# Altium schematic sheet GSM LED Indicators.SchDoc: GSM Modem Signal Indicator LED's
size A3; DocumentNumber: 12; SheetNumber: 12; SheetTotal: 54
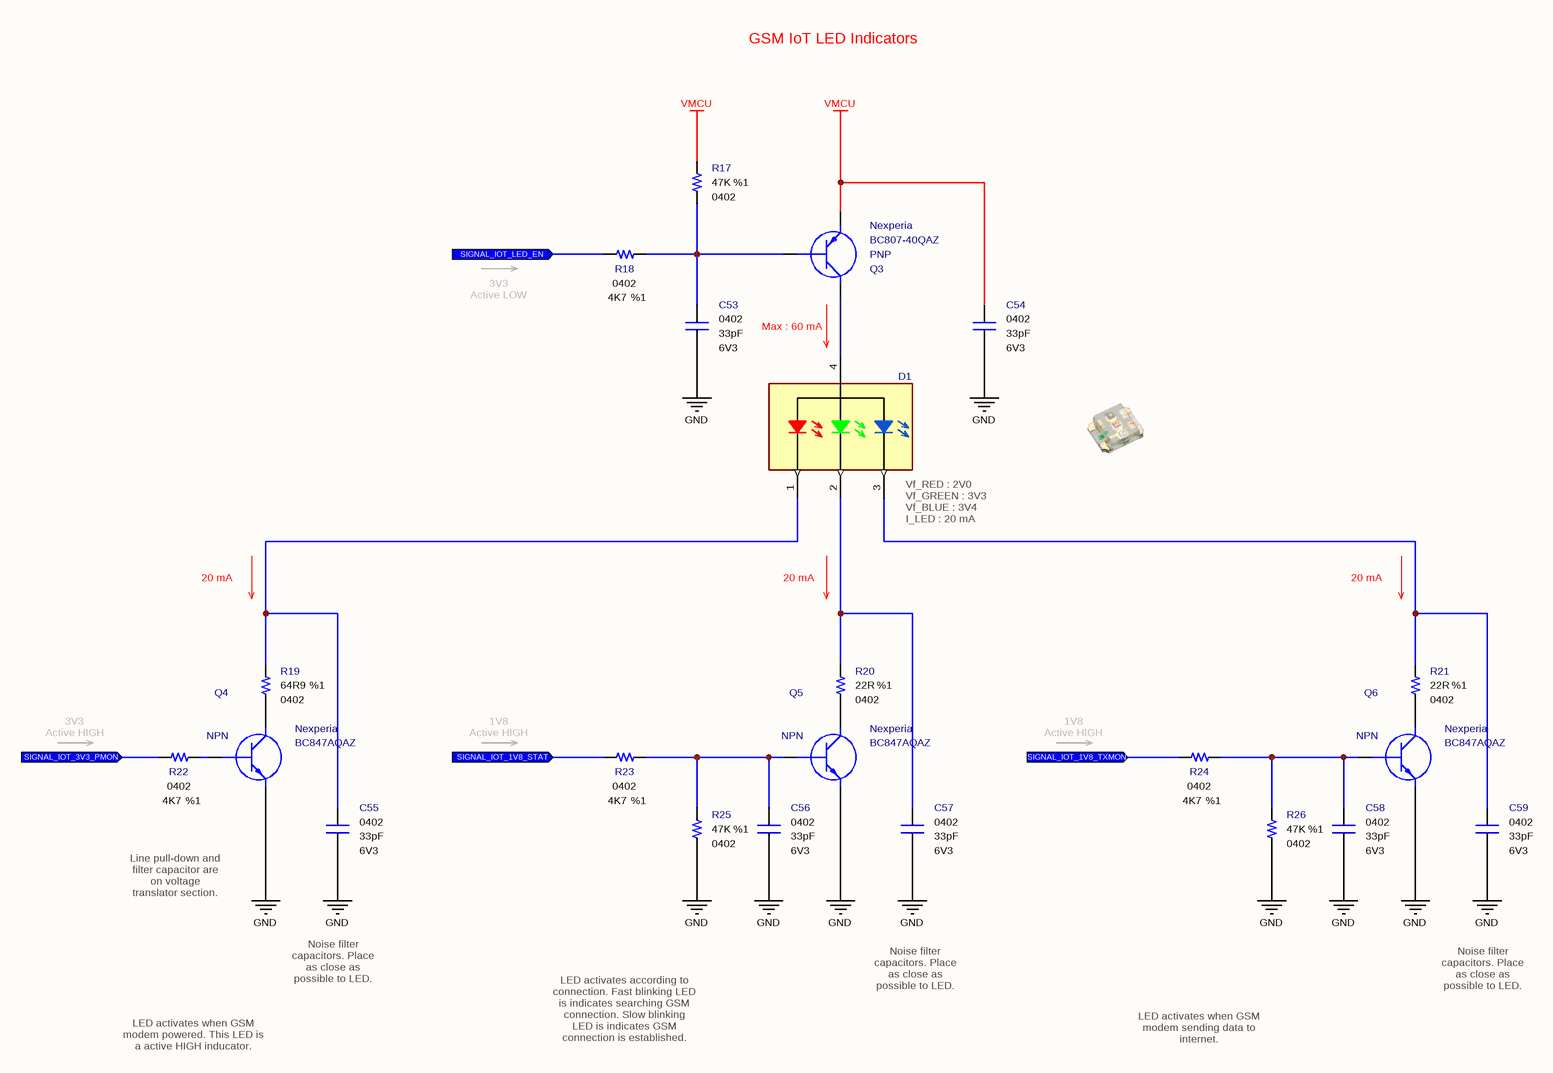
[diagram p0: GSM LED Indicators.SchDoc]

## Parts
C53  value 33pF  Case: 0402  Voltage: 6V3  [CAPACITOR_0402]  (hidden comment: Multilayer Ceramic Capacitor)
C54  value 33pF  Case: 0402  Voltage: 6V3  [CAPACITOR_0402]  (hidden comment: Multilayer Ceramic Capacitor)
C55  value 33pF  Case: 0402  Voltage: 6V3  [CAPACITOR_0402]  (hidden comment: Multilayer Ceramic Capacitor)
C56  value 33pF  Case: 0402  Voltage: 6V3  [CAPACITOR_0402]  (hidden comment: Multilayer Ceramic Capacitor)
C57  value 33pF  Case: 0402  Voltage: 6V3  [CAPACITOR_0402]  (hidden comment: Multilayer Ceramic Capacitor)
C58  value 33pF  Case: 0402  Voltage: 6V3  [CAPACITOR_0402]  (hidden comment: Multilayer Ceramic Capacitor)
C59  value 33pF  Case: 0402  Voltage: 6V3  [CAPACITOR_0402]  (hidden comment: Multilayer Ceramic Capacitor)
D1  150066M153000  [Wurth_0606]  (value not drawn)
Q3  Polarity: PNP  Manufacturer Name: Nexperia  Manufacturer Part Number: BC807-40QAZ  [SOT1215]  (hidden comment: Bipolar PNP Transistors)
Q4  Polarity: NPN  Manufacturer Name: Nexperia  Manufacturer Part Number: BC847AQAZ  [SOT1215]  (hidden comment: Bipolar NPN Transistors)
Q5  Polarity: NPN  Manufacturer Name: Nexperia  Manufacturer Part Number: BC847AQAZ  [SOT1215]  (hidden comment: Bipolar NPN Transistors)
Q6  Polarity: NPN  Manufacturer Name: Nexperia  Manufacturer Part Number: BC847AQAZ  [SOT1215]  (hidden comment: Bipolar NPN Transistors)
R17  value 47K  Tolerance: %1  Case: 0402  [RESISTOR_0402]  (hidden comment: Thick Film Resistor)
R18  value 4K7  Tolerance: %1  Case: 0402  [RESISTOR_0402]  (hidden comment: Thick Film Resistor)
R19  value 64R9  Tolerance: %1  Case: 0402  [RESISTOR_0402]  (hidden comment: Thick Film Resistor)
R20  value 22R  Tolerance: %1  Case: 0402  [RESISTOR_0402]  (hidden comment: Thick Film Resistor)
R21  value 22R  Tolerance: %1  Case: 0402  [RESISTOR_0402]  (hidden comment: Thick Film Resistor)
R22  value 4K7  Tolerance: %1  Case: 0402  [RESISTOR_0402]  (hidden comment: Thick Film Resistor)
R23  value 4K7  Tolerance: %1  Case: 0402  [RESISTOR_0402]  (hidden comment: Thick Film Resistor)
R24  value 4K7  Tolerance: %1  Case: 0402  [RESISTOR_0402]  (hidden comment: Thick Film Resistor)
R25  value 47K  Tolerance: %1  Case: 0402  [RESISTOR_0402]  (hidden comment: Thick Film Resistor)
R26  value 47K  Tolerance: %1  Case: 0402  [RESISTOR_0402]  (hidden comment: Thick Film Resistor)

## Ports
SIGNAL_IOT_1V8_STAT (in), SIGNAL_IOT_1V8_TXMON (in), SIGNAL_IOT_3V3_PMON (in), SIGNAL_IOT_LED_EN (in)

## Nets
GND: C53.2 C54.2 C55.2 C56.2 C57.2 C58.2 C59.2 Q4.2(E) Q5.2(E) Q6.2(E) R25.1 R26.1
VMCU: C54.1 Q3.2(E) R17.2
SIGNAL_IOT_1V8_STAT: R23.2 ; port SIGNAL_IOT_1V8_STAT
SIGNAL_IOT_1V8_TXMON: R24.2 ; port SIGNAL_IOT_1V8_TXMON
SIGNAL_IOT_3V3_PMON: R22.2 ; port SIGNAL_IOT_3V3_PMON
SIGNAL_IOT_LED_EN: R18.2 ; port SIGNAL_IOT_LED_EN
NetC53_1: C53.1 Q3.1(B) R17.1 R18.1
NetC55_1: C55.1 D1.1 R19.2
NetC56_1: C56.1 Q5.1(B) R23.1 R25.2
NetC57_1: C57.1 D1.2 R20.2
NetC58_1: C58.1 Q6.1(B) R24.1 R26.2
NetC59_1: C59.1 D1.3 R21.2
NetD1_4: D1.4 Q3.3(C)
NetQ4_1: Q4.1(B) R22.1
NetQ4_3: Q4.3(C) R19.1
NetQ5_3: Q5.3(C) R20.1
NetQ6_3: Q6.3(C) R21.1

## Notes on the sheet
- GSM IoT LED Indicators
- 3V3
  Active LOW
- Max : 60 mA
- (near D1) Vf_RED : 2V0
  Vf_GREEN : 3V3
  Vf_BLUE : 3V4
  I_LED : 20 mA
- 20 mA
- 3V3
  Active HIGH
- 1V8
  Active HIGH
- Line pull-down and filter capacitor are on voltage translator section.
- Noise filter capacitors. Place as close as possible to LED.
- LED activates when GSM modem powered. This LED is a active HIGH inducator.
- LED activates according to connection. Fast blinking LED is indicates searching GSM connection. Slow blinking LED is indicates GSM connection is established.
- LED activates when GSM modem sending data to internet.
- Engineer
- All Rights are reserved to Customer and Engineer. [2021]
- Size:
- Date:
- A3
- Project :
- Time:
- Sheet
- of
- Customer
- Product ID
- Module ID
- Version
- File:
- Revision

## Library data of the parts
C53-C59 = Capacitor - 33pF [0402-6V3]: Capacitor - 33pF [0402] (Ceramic); Manufacturer Name: Kemet; Manufacturer Part Number: C0402C330J9RACAUTO; Dielectric: X7R; Tolerance: 10%; Height: 0.5mm; Maximum Operating Temperature: +125; Minimum Operating Temperature: -55; ROHS: Yes; ComponentLink1Description: DataSheet; ComponentLink1URL: https://api.kemet.com/component-edge/download/datasheet/C0402C330J9RACAUTO.pdf; ComponentLink2Description: Mouser; ComponentLink2URL: https://www.mouser.com/Search/Refine.aspx?Keyword=80-C0402C330J9RAUTO; Supplier 1: Mouser; Supplier Part Number 1: 80-C0402C330J9RAUTO; Mouser Part Number: 80-C0402C330J9RAUTO
D1 = Diode - RGB LED (150066M153000): Standard LEDs - SMD PICOLED series Red LED; Manufacturer Name: Wurth Elektronik; Datasheet Link: https://www.mouser.com.tr/datasheet/2/445/150066M153000-1715259.pdf; Manufacturer Part Number: 150066M153000; Mouser Part Number: 710-150066M153000; Mouser Price/Stock: https://www.mouser.com.tr/ProductDetail/ROHM-Semiconductor/SML-P12U2TT86R?qs=sGAEpiMZZMseGfSY3csMkRIBDsfU3UCXJTULB5gem9Ta%252Bp%252BvZ709fg%3D%3D; Case: 0606; ROHS: Yes; Supplier 1: RSComponents; Supplier 2: RSComponents; Supplier 3: Mouser; Supplier 4: Farnell; Supplier 5: Digi-Key; Supplier 6: Digi-Key; Supplier 7: Digi-Key; Supplier 8: Newark; Supplier Part Number 1: 1765006; Supplier Part Number 2: 1766050; Supplier Part Number 3: 710-150066M153000; Supplier Part Number 4: 2764964; Supplier Part Number 5: 732-11390-1-ND; Supplier Part Number 6: 732-11390-6-ND; Supplier Part Number 7: 732-11390-2-ND; Supplier Part Number 8: 22AC3253
Q3 = Transistor - BC807: Bipolar Transistors - BJT 45 V, 500 mA PNP gen purpose transistors; Mouser Part Number: 771-BC807-40QAZ; ComponentLink1Description: DataSheet; ComponentLink1URL: https://www.mouser.com.tr/datasheet/2/916/BC807-25QA_40QA-1665956.pdf; ComponentLink2Description: Mouser; ComponentLink2URL: https://www.mouser.com.tr/ProductDetail/Nexperia/BC807-40QAZ?qs=sGAEpiMZZMshyDBzk1%2FWi8mfWMj7sMzapbI3Mu1S6AqR9y7krhZTdA%3D%3D; Supplier 1: Mouser; Supplier 2: Arrow; Supplier 3: Digi-Key; Supplier 4: Digi-Key; Supplier Part Number 1: 771-BC807-40QAZ; Supplier Part Number 2: BC807-40QAZ; Supplier Part Number 3: 1727-2242-1-ND; Supplier Part Number 4: 1727-2242-6-ND; Case: DFN-1010D-3
Q4-Q6 = Transistor - BC847: Bipolar Transistors - BJT BC847AQA/DFN1010D-3/REEL 7" Q2; ComponentLink1Description: DataSheet; ComponentLink1URL: https://www.mouser.com.tr/datasheet/2/916/BC847XQA_SER-1598405.pdf; ComponentLink2Description: Mouser; ComponentLink2URL: https://www.mouser.com.tr/ProductDetail/Nexperia/BC847AQAZ?qs=%2Fha2pyFaduhKMCPKNtQimeJpXTw9z4AqURd2YARs8DVICZNv3AT9Dw%3D%3D; Case: DFN-1010D-3; Supplier 1: Mouser; Supplier 2: Digi-Key; Supplier Part Number 1: 771-BC847AQAZ; Supplier Part Number 2: 1727-2545-1-ND; Mouser Part Number: 771-BC847AQAZ
R17 R25 R26 = Resistor - 47K: Thick Film Resistors - SMD 1/16 W 47 Kohms 1%; Manufacturer Name: Vishay; Manufacturer Part Number: CRCW040247K0FKED; Height: 0.4mm; ComponentLink1Description: DataSheet; ComponentLink1URL: https://www.mouser.com.tr/datasheet/2/427/dcrcwe3-1762152.pdf; ComponentLink2Description: Mouser; ComponentLink2URL: https://www.mouser.com.tr/ProductDetail/Vishay-Dale/CRCW040247K0FKED?qs=sGAEpiMZZMu61qfTUdNhG2DpbjADlD3GL%252B3h1elTxqU%3D; Supplier 1: Mouser; Supplier 2: Digi-Key; Supplier Part Number 1: 71-CRCW040247K0FKEDH; Supplier Part Number 2: 541-47.0KYCT-ND; Mouser Part Number: 71-CRCW0402-47K-E3
R18 R22-R24 = Resistor - 4K7: Thick Film Resistors - SMD 1/16 W 4.7 Kohms 1%; Manufacturer Name: Vishay; Manufacturer Part Number: CRCW04024K70FKED; Height: 0.4mm; Mouser Part Number: 71-CRCW0402-4.7K-E3; ComponentLink1Description: DataSheet; ComponentLink1URL: https://www.mouser.com.tr/datasheet/2/427/dcrcwe3-1762152.pdf; ComponentLink2Description: Mouser; ComponentLink2URL: https://www.mouser.com.tr/ProductDetail/Vishay-Dale/CRCW04024K70FKED?qs=sGAEpiMZZMu61qfTUdNhG7nHf%2F6MTUn3HadIdDQu24Q%3D; Supplier 1: Mouser; Supplier 2: Digi-Key; Supplier Part Number 2: 541-4.70KLCT-ND; Supplier Part Number 1: 71-CRCW0402-4.7K-E3
R19 = Resistor - 64R9: Thick Film Resistors - SMD 1/16 W 64R9 Ohms 1%; Manufacturer Name: Vishay; Manufacturer Part Number: CRCW040264R9FKED; Height: 0.35mm; Mouser Part Number: 71-CRCW0402-64.9-E3; ComponentLink1Description: DataSheet; ComponentLink1URL: https://www.mouser.com.tr/datasheet/2/427/dcrcwe3-1762152.pdf; ComponentLink2Description: Mouser; ComponentLink2URL: https://www.mouser.com.tr/ProductDetail/Vishay-Dale/CRCW040264R9FKED/?qs=DKbL89i6OErClCPxVYdf6Q%3D%3D; Supplier 1: Future Electronics; Supplier 2: Future Electronics; Supplier 3: Mouser; Supplier 4: Farnell; Supplier 5: Digi-Key; Supplier 6: Digi-Key; Supplier 7: Digi-Key; Supplier 8: Newark; Supplier Part Number 1: 8103763; Supplier Part Number 2: 5785985; Supplier Part Number 3: 71-CRCW0402-64.9-E3; Supplier Part Number 4: 2140657; Supplier Part Number 5: 541-64.9LCT-ND; Supplier Part Number 6: 541-64.9LDKR-ND; Supplier Part Number 7: 541-64.9LTR-ND; Supplier Part Number 8: 27W4015
R20 R21 = Resistor - 22R: Thick Film Resistors - SMD 1/16 W 22R Ohms 1%; Manufacturer Name: Vishay; Manufacturer Part Number: CRCW040222R0FKED; Height: 0.35mm; Mouser Part Number: 71-CRCW0402-22-E3; ComponentLink1Description: DataSheet; ComponentLink1URL: https://www.mouser.com.tr/datasheet/2/427/dcrcwe3-1762152.pdf; ComponentLink2Description: Mouser; ComponentLink2URL: https://www.mouser.com.tr/ProductDetail/Vishay-Dale/CRCW040264R9FKED/?qs=DKbL89i6OErClCPxVYdf6Q%3D%3D; Supplier 1: RSComponents; Supplier 2: Avnet; Supplier 3: RSComponents; Supplier 4: Future Electronics; Supplier 5: Arrow Electronics; Supplier Part Number 1: 6788983; Supplier Part Number 2: 52K6847; Supplier Part Number 3: 6788983P; Supplier Part Number 4: 3103732; Supplier Part Number 5: CRCW040222R0FKED